# Altium schematic sheet Main_DC-DC_Converter.SchDoc
size A3; SheetNumber: 5; SheetTotal: 6; SPICEModelCacheKWJYRVGK: <root> / <DocumentId>KWJYRVGK</DocumentId> / <CacheFrame Number="0"> / <Model Name="cap" Kind="MDL"> / <Text>*Default semiconductor capacitor / .MODEL CAP C()</Text> / </Model> / <Model Name="skydiode" Kind="MDL"> / <Text>*Default Schottky Diode / *Schottky Diode Pinout: A,K / .MODEL SKYDIODE D(EG=0.69 XTI=2)</Text> / </Model> / <Model Name="led2" Kind="MDL"> / <Text>*Typ RED,GREEN,YELLOW,AMBER GaAs LED: Vf=2.1V Vr=4V If=40mA trr=3uS / *LED Pinout: 1=A, 2=K / .MODEL LED2 D (IS=93.1P RS=42M N=4.61 BV=4 IBV=10U / + CJO=2.97P VJ=.75 M=.333 TT=4.32U)</Text> / </Model> / </CacheFrame> / </root>
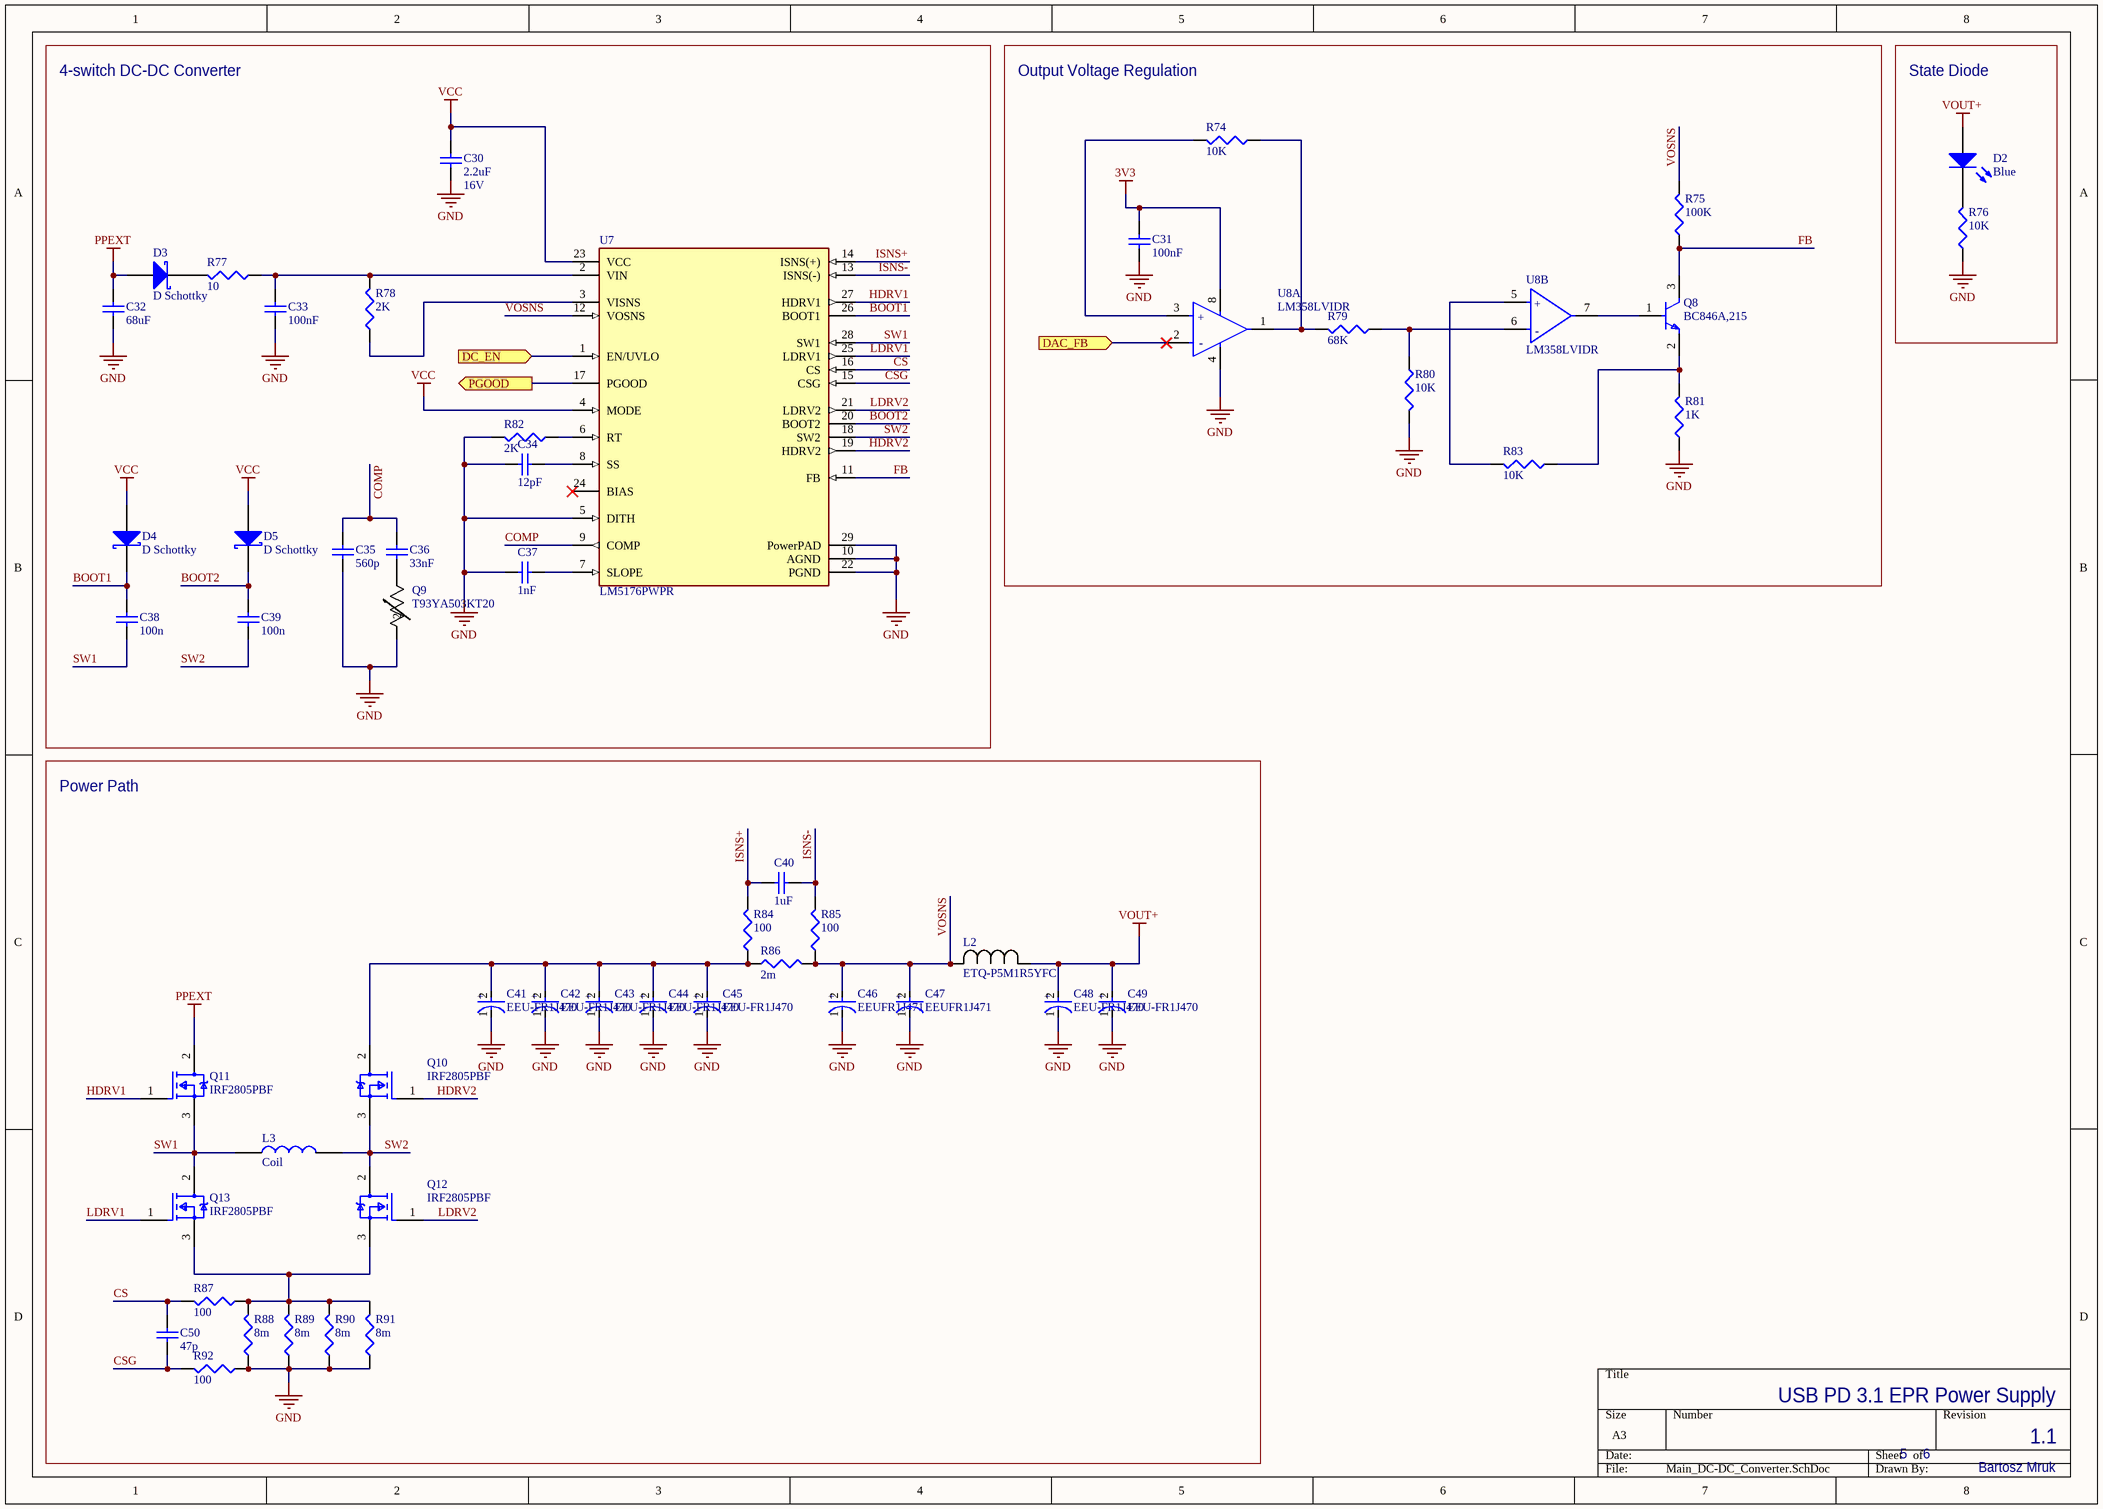
[diagram p0: Main_DC-DC_Converter.SchDoc]

## Parts
C30  16V  value 2.2uF  [C1206]
C31  value 100nF  [C1206]  (hidden comment: Cap Semi)
C32  value 68uF  [C1206]  (hidden comment: Cap Semi)
C33  value 100nF  [C1206]  (hidden comment: Cap Semi)
C34  value 12pF  [C1206]  (hidden comment: Cap Semi)
C35  value 560p  [C1206]  (hidden comment: Cap Semi)
C36  value 33nF  [C1206]  (hidden comment: Cap Semi)
C37  value 1nF  [C1206]  (hidden comment: Cap Semi)
C38  value 100n  [C1206]  (hidden comment: Cap Semi)
C39  value 100n  [C1206]  (hidden comment: Cap Semi)
C40  value 1uF  [C1206]  (hidden comment: Cap Semi)
C41  EEU-FR1J470  [FP-EEU-FR1J470-MFG]
C42  EEU-FR1J470  [FP-EEU-FR1J470-MFG]
C43  EEU-FR1J470  [FP-EEU-FR1J470-MFG]
C44  EEU-FR1J470  [FP-EEU-FR1J470-MFG]
C45  EEU-FR1J470  [FP-EEU-FR1J470-MFG]
C46  EEUFR1J471  [FP-RAD-TH-D_12_5_0_5-L_25-MFG]
C47  EEUFR1J471  [FP-RAD-TH-D_12_5_0_5-L_25-MFG]
C48  EEU-FR1J470  [FP-EEU-FR1J470-MFG]
C49  EEU-FR1J470  [FP-EEU-FR1J470-MFG]
C50  value 47p  [C1206]  (hidden comment: Cap Semi)
D2  Blue  [3.2X1.6X1.1]
D3  D Schottky  [SMB]
D4  D Schottky  [SMB]
D5  D Schottky  [SMB]
L2  ETQ-P5M1R5YFC  [IND_PCC-M1054M_PAN]
L3  Coil  [744711003]
Q8  BC846A,215  [FP-SOT23-IPC_A]
Q9  T93YA503KT20  [TRIM_503KT20_VIS]
Q10  IRF2805PBF  [FP-PG-TO220-3-MFG]
Q11  IRF2805PBF  [FP-PG-TO220-3-MFG]
Q12  IRF2805PBF  [FP-PG-TO220-3-MFG]
Q13  IRF2805PBF  [FP-PG-TO220-3-MFG]
R74  value 10K  [J1-0603]  (hidden comment: Res3)
R75  value 100K  [J1-0603]  (hidden comment: Res3)
R76  value 10K  [J1-0603]  (hidden comment: Res3)
R77  value 10  [J1-0603]  (hidden comment: Res3)
R78  value 2K  [J1-0603]  (hidden comment: Res3)
R79  value 68K  [J1-0603]  (hidden comment: Res3)
R80  value 10K  [J1-0603]  (hidden comment: Res3)
R81  value 1K  [J1-0603]  (hidden comment: Res3)
R82  value 2K  [J1-0603]  (hidden comment: Res3)
R83  value 10K  [J1-0603]  (hidden comment: Res3)
R84  value 100  [J1-0603]  (hidden comment: Res3)
R85  value 100  [J1-0603]  (hidden comment: Res3)
R86  value 2m  [RESC6332]  (hidden comment: Res3)
R87  value 100  [J1-0603]  (hidden comment: Res3)
R88  value 8m  [RESC6332]  (hidden comment: Res3)
R89  value 8m  [RESC6332]  (hidden comment: Res3)
R90  value 8m  [RESC6332]  (hidden comment: Res3)
R91  value 8m  [RESC6332]  (hidden comment: Res3)
R92  value 100  [J1-0603]  (hidden comment: Res3)
U7  LM5176PWPR  [FP-PWP0028C-IPC_C]
U8  LM358LVIDR  [FP-D0008A-IPC_A]  (parts A,B of 2)

## Blocks framed on the sheet
4-switch DC-DC Converter: C30 C32-C39 D3-D5 Q9 R77 R78 R82 U7
Output Voltage Regulation: C31 Q8 R74 R75 R79-R81 R83 U8
State Diode: D2 R76
Power Path: C40-C50 L2 L3 Q10-Q13 R84-R92

## Ports
DAC_FB (in), DC_EN (in), PGOOD (out)

## Nets
3V3: C31.2 U8.8(V+)
GND: C30.1 C31.1 C32.1 C33.1 C34.2 C35.1 C37.2 C41.1(C) C42.1(C) C43.1(C) C44.1(C) C45.1(C) C46.1(C) C47.1(C) C48.1(C) C49.1(C) Q9.2 R76.1 R80.2 R81.1 R82.2 R88.1 R89.1 R90.1 R91.1 R92.1 U7.5(DITH) U7.10(AGND) U7.22(PGND) U7.29(PowerPAD) U8.4(V-)
PPEXT: C32.2 D3.1(A) Q11.2(D)
VCC: C30.2 D4.1(A) D5.1(A) U7.4(MODE) U7.23(VCC)
VOUT+: C48.2(A) C49.2(A) D2.1(A) L2.1
BOOT1: C38.2 D4.2(K) U7.26(BOOT1)
BOOT2: C39.2 D5.2(K) U7.20(BOOT2)
COMP: C35.2 C36.2 U7.9(COMP)
CS: C50.2 R87.2 U7.16(CS)
CSG: C50.1 R92.2 U7.15(CSG)
DAC_FB: U8.2(IN1-) ; port DAC_FB
DC_EN: U7.1(EN/UVLO) ; port DC_EN
FB: Q8.3(C) R75.1 U7.11(FB)
HDRV1: Q11.1(G) U7.27(HDRV1)
HDRV2: Q10.1(G) U7.19(HDRV2)
ISNS+: C40.1 R84.2 U7.14(ISNS(+))
ISNS-: C40.2 R85.2 U7.13(ISNS(-))
LDRV1: Q13.1(G) U7.25(LDRV1)
LDRV2: Q12.1(G) U7.21(LDRV2)
PGOOD: U7.17(PGOOD) ; port PGOOD
SW1: C38.1 L3.1 Q11.3(S) Q13.2(D) U7.28(SW1)
SW2: C39.1 L3.2 Q10.3(S) Q12.2(D) U7.18(SW2)
VOSNS: C46.2(A) C47.2(A) L2.2 R75.2 R85.1 R86.2 U7.12(VOSNS)
NetC33_2: C33.2 R77.1 R78.2 U7.2(VIN)
NetC34_1: C34.1 U7.8(SS)
NetC36_1: C36.1 Q9.1
NetC37_1: C37.1 U7.7(SLOPE)
NetC41_2: C41.2(A) C42.2(A) C43.2(A) C44.2(A) C45.2(A) Q10.2(D) R84.1 R86.1
NetD2_2: D2.2(K) R76.2
NetD3_2: D3.2(K) R77.2
NetQ8_1: Q8.1(B) U8.7(OUT2)
NetQ8_2: Q8.2(E) R81.2 R83.1
NetQ12_3: Q12.3(S) Q13.3(S) R87.1 R88.2 R89.2 R90.2 R91.2
NetR74_1: R74.1 R79.2 U8.1(OUT1)
NetR74_2: R74.2 U8.3(IN1+)
NetR78_1: R78.1 U7.3(VISNS)
NetR79_1: R79.1 R80.1 U8.6(IN2-)
NetR82_1: R82.1 U7.6(RT)
NetR83_2: R83.2 U8.5(IN2+)

Not connected (* = marked no-connect by the designer): U7 24(BIAS)*

## Notes on the sheet
- 5
- 6
- 1.1
- USB PD 3.1 EPR Power Supply
- Bartosz Mruk
- (in symbol CMP-04895-000442-1, part A) +; -
- (in symbol CMP-04895-000442-1, part B) +; -
- (in symbol CMP-05427-000066-1) +
- (in symbol CMP-05427-000281-1) +

## Library data of the parts
C30-C40 C50 = Cap Semi: Capacitor (Semiconductor SIM Model); Published: 8-Jun-2000; LatestRevisionDate: 29-May-2009; LatestRevisionNote: IPC-7351 Footprint Added.; PackageReference: C1206; Publisher: Altium Limited; PackageDescription: Chip Capacitor
C41-C45 C48 C49 = CMP-05427-000066-1: CAP ALUM 47UF 20% 63V RADIAL; ESR (Equivalent Series Resistance): 210mR; Lead Diameter: 0.5mm; Life (Hours): 5000Hour; Ripple Current (AC): 284mA; Height - Seated (Max): 0.5inch; Radiation Hardening: No; Termination: Radial; Contact Plating: Tin; Length: 11.2mm; Tolerance: 20%; Voltage: 63V; Max Operating Temperature: 105°C; Construction: Cylindrical; Lead Free: Lead Free; Series: FR; Mount: Through Hole; Lead Pitch: 2.5mm; Capacitance: 47uF; Case/Package: Radial; Voltage Rating (DC): 63V; Diameter: 6.3mm; Impedance: 210mR; RoHS Compliant: Yes; Height: 11.2mm; REACH SVHC: No SVHC; Package Quantity: 200; Ripple Current: 284mA; Voltage Rating: 63V; Packaging: Bulk; Min Operating Temperature: -40°C
C46 C47 = CMP-05427-000281-1: Aluminum Electrolytic Capacitors (Radial Lead Type) 470uF ±20% 63V; Impedance: 27mR; Lead Diameter: 0.6mm; Ripple Current: 1.995A; Life (Hours): 10000Hour; Series: FR; Tolerance: 20%; Max Operating Temperature: 105°C; Diameter: 12.5mm; Height - Seated (Max): 1.063inch; Termination: Radial; Voltage Rating: 63V; Contact Plating: Tin; Height: 25mm; Case/Package: Radial; Packaging: Bulk; Length: 25mm; Mount: Through Hole; Construction: Cylindrical; Package Quantity: 100; Ripple Current (AC): 1.995A; Radiation Hardening: No; Voltage: 63V; Capacitance: 470uF; RoHS Compliant: Yes; Min Operating Temperature: -40°C; ESR (Equivalent Series Resistance): 27mR; Lead Free: Lead Free; Lead Pitch: 5mm; Voltage Rating (DC): 63V
D2 = LED2: Typical RED, GREEN, YELLOW, AMBER GaAs LED; Published: 8-Jun-2000; LatestRevisionDate: 17-Jul-2002; LatestRevisionNote: Re-released for DXP Platform.; PackageVersion: Feb-2002; PackageReference: 3.2X1.6X1.1; Publisher: Altium Limited; PackageDescription: SM LED; 2 Flat Leads
D3-D5 = D Schottky: Schottky Diode; Published: 8-Jun-2000; LatestRevisionDate: 17-Jul-2002; LatestRevisionNote: Re-released for DXP Platform.; PackageReference: SMB; Publisher: Altium Limited; PackageDescription: DO-214-AA/SMB; 2 C-Bend Leads; Body 5.3 x 3.6 mm, inc. leads (LxW); Code_JEDEC: DO-214-AA
L2 = ETQ-P5M1R5YFC: No Description Available; Manufacturer_Name: Panasonic; Copyright: Copyright (C) 2025 Ultra Librarian. All rights reserved.; Manufacturer_Part_Number: ETQ-P5M1R5YFC
Q8 = CMP-14406-000010-1: TRANS NPN 65V 0.1A SOT23; Manufacturer: Nexperia; Collector Emitter Saturation Voltage: 200mV; Hfe Max: 450; Number Of Npn: 1; Max Junction Temp: +150°C; Hfe Min: 110; Power Dissipation: 250mW; Collector Base Voltage: 80V; Unity Gain Freq: 100MHz; Hfe Testvce: 5V; Emitter Base Voltage: 6V; Max Collector Current: 100mA; Rthja Max: 500K/W; Hfe Testic: 2mA; Automotive Grade: Grade 0; Temperature: to +150°C; Category: Trans; Octopart: https://octopart.com/bc846a%2C215-nexperia-78739089; Device Class L2: Transistors; ComponentLink2Description: Datasheet; Collector Emitter Voltage: 65V; Device Class L1: Discrete Semiconductors; Digikey Description: TRANS NPN 65V 0.1A SOT23; Package: SOT23; Manufacturer Part Number: BC846A,215; Footprint Url: https://assets.nexperia.com/documents/outline-drawing/SOT23.pdf; RoHS: TRUE; Device Class L3: BJTs; Ambient Temperature Range Low: -65°C; ComponentLink2URL: https://assets.nexperia.com/documents/data-sheet/BC846_SER.pdf; Temperature Range High: +150°C; Lead Free: Yes; Height: 1.1mm; Mouser Description: BC846 Series 65 V 100 mA NPN SMT General Purpose Transistor - SOT-23; Automotive: Yes; Number Of Elements: 1; Ambient Temperature Range High: +150°C
Q9 = T93YA503KT20: T93 YA 50K 10% TU50 e3; Manufacturer_Name: Vishay; Type: Trimmer Potentiometers; Copyright: Copyright (C) 2025 Ultra Librarian. All rights reserved.; Manufacturer_Part_Number: T93YA503KT20; Datasheet: https://www.vishay.com/doc?51026
Q10-Q13 = CMP-32901-001056-1: MOSFET N-CH 55V 75A TO220AB; Element Configuration: Single; Drain to Source Resistance: 4.7mR; Power Dissipation: 330W; Threshold Voltage: 4V; Turn-On Delay Time: 14ns; Gate to Source Voltage (Vgs): 20V; Polarization: N; Turn-Off Delay Time: 68ns; Input Capacitance: 5.11nF; Max Dual Supply Voltage: 55V; Number of Pins: 3; RoHS Compliant: Yes; REACH SVHC: No SVHC; Case/Package: TO-220; Rds On Max: 4.7mR; Width: 0.19inch; Min Operating Temperature: -55°C; Drain to Source Breakdown Voltage: 55V; Packaging: Rail/Tube; Lead Free: Lead Free; Length: 0.42inch; Max Operating Temperature: 175°C; Series: HEXFET®; Drain to Source Voltage (Vdss): 55V; Max Power Dissipation: 330W; Continuous Drain Current (ID): 75A; Height: 0.65inch; Halogen Free: Halogen Free; Mount: Through Hole
R74-R92 = Res3: Resistor; Published: 8-Jun-2000; LatestRevisionDate: 29-May-2009; LatestRevisionNote: IPC-7351 Footprint Added.; PackageReference: J1-0603; Publisher: Altium Limited; PackageDescription: Chip Resistor
U7 = CMP-04918-000350-1: Switching Frequency: 600kHz; Max Duty Cycle: 100%; Number of Output Phases: 1; Output Configuration: Positive; Clock Sync: Yes; Topology: Buck-Boost; Packaging: Tape and Reel; Number of Outputs: 1; Number of Pins: 28; Min Operating Temperature: -40°C; Max Operating Temperature: 125°C; Synchronous Rectifier: Yes; RoHS Compliant: Yes
U8 = CMP-04895-000442-1: IC OPAMP GP 2 CIRCUIT 8SOIC; Output Current per Channel: 40mA; Input Offset Voltage (Vos): 1mV; Operating Supply Current: 90uA; Number of Circuits: 2; Input Bias Current: 15pA; Slew Rate: 1.5V/µs; Gain Bandwidth Product: 1MHz; Number of Pins: 8; Mount: Surface Mount; Packaging: Cut Tape; RoHS Compliant: Yes; Case/Package: SOIC; Min Operating Temperature: -40°C; Max Operating Temperature: 125°C